# EAGLE design PowerBUS7 (EAGLE 7.5.0)
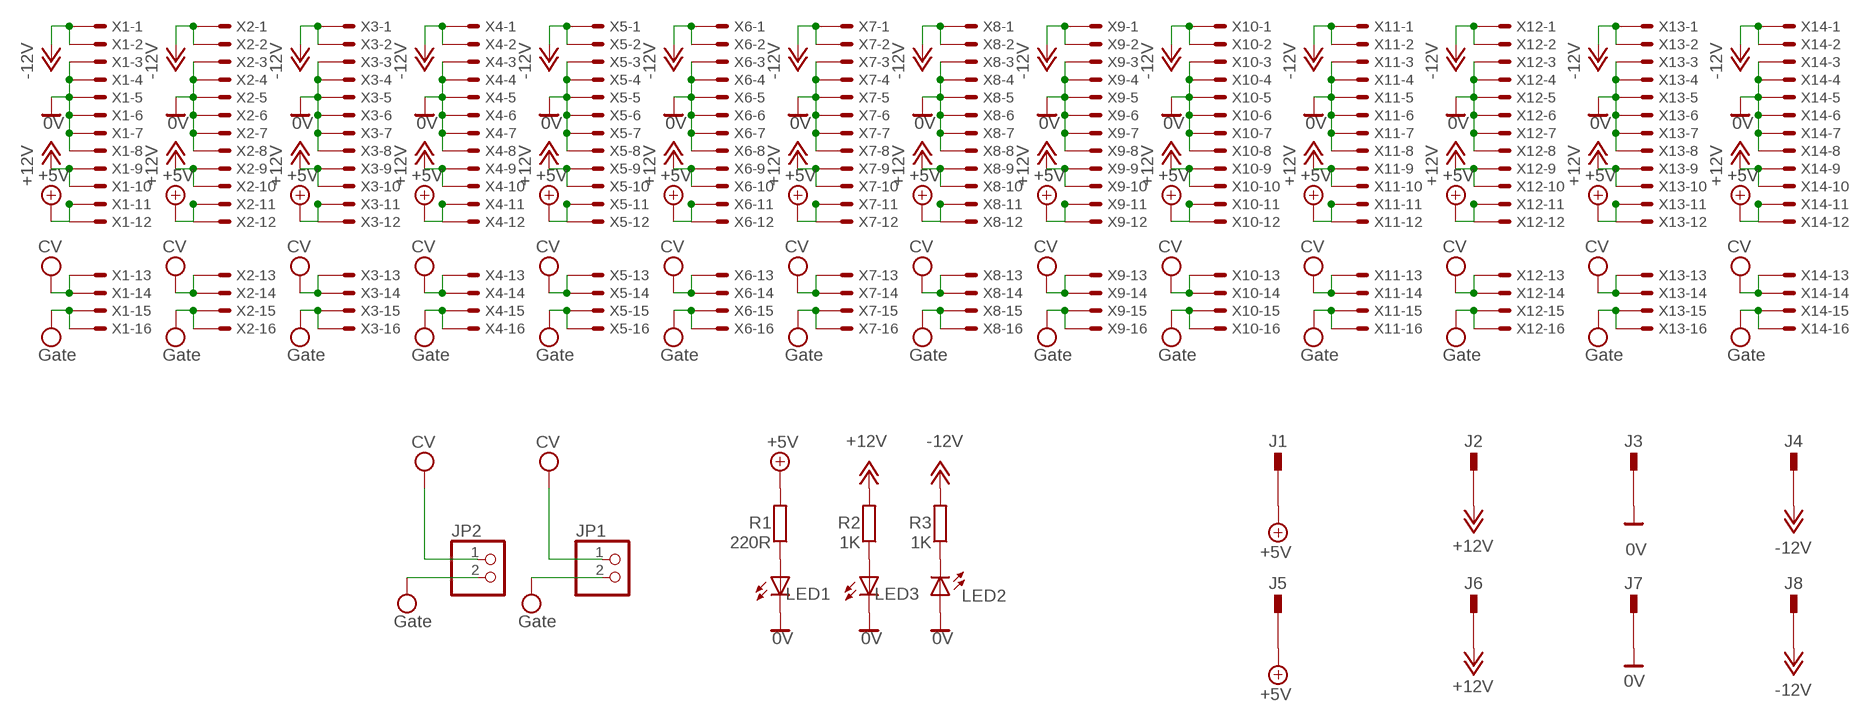
[diagram p0: schematic, sheet 1]

## Parts
J1  PIN2F061.040  [F061.040]
J2  PIN2F061.040  [F061.040]
J3  PIN2F061.040  [F061.040]
J4  PIN2F061.040  [F061.040]
J5  PIN2F061.040  [F061.040]
J6  PIN2F061.040  [F061.040]
J7  PIN2F061.040  [F061.040]
J8  PIN2F061.040  [F061.040]
JP1  PINHD-1X2  [1X02]
JP2  PINHD-1X2  [1X02]
LED1  LED5MM  [LED5MM]
LED2  LED5MM  [LED5MM]
LED3  LED5MM  [LED5MM]
R1  220R  R-EU_0204/5  [0204/5]
R2  1K  R-EU_0204/5  [0204/5]
R3  1K  R-EU_0204/5  [0204/5]
X1  057-016-1  [057-016-1]
X2  057-016-1  [057-016-1]
X3  057-016-1  [057-016-1]
X4  057-016-1  [057-016-1]
X5  057-016-1  [057-016-1]
X6  057-016-1  [057-016-1]
X7  057-016-1  [057-016-1]
X8  057-016-1  [057-016-1]
X9  057-016-1  [057-016-1]
X10  057-016-1  [057-016-1]
X11  057-016-1  [057-016-1]
X12  057-016-1  [057-016-1]
X13  057-016-1  [057-016-1]
X14  057-016-1  [057-016-1]

## Nets
0V: J3.A1 J3.A2 J7.A1 J7.A2 LED1.K(C) LED2.A LED3.K(C) X1.3 X1.4 X1.5 X1.6 X1.7 X1.8 X2.3 X2.4 X2.5 X2.6 X2.7 X2.8 X3.3 X3.4 X3.5 X3.6 X3.7 X3.8 X4.3 X4.4 X4.5 X4.6 X4.7 X4.8 X5.3 X5.4 X5.5 X5.6 X5.7 X5.8 X6.3 X6.4 X6.5 X6.6 X6.7 X6.8 X7.3 X7.4 X7.5 X7.6 X7.7 X7.8 X8.3 X8.4 X8.5 X8.6 X8.7 X8.8 X9.3 X9.4 X9.5 X9.6 X9.7 X9.8 X10.3 X10.4 X10.5 X10.6 X10.7 X10.8 X11.3 X11.4 X11.5 X11.6 X11.7 X11.8 X12.3 X12.4 X12.5 X12.6 X12.7 X12.8 X13.3 X13.4 X13.5 X13.6 X13.7 X13.8 X14.3 X14.4 X14.5 X14.6 X14.7 X14.8
+5V: J1.A1 J1.A2 J5.A1 J5.A2 R1.2 X1.11 X1.12 X2.11 X2.12 X3.11 X3.12 X4.11 X4.12 X5.11 X5.12 X6.11 X6.12 X7.11 X7.12 X8.11 X8.12 X9.11 X9.12 X10.11 X10.12 X11.11 X11.12 X12.11 X12.12 X13.11 X13.12 X14.11 X14.12
+12V: J2.A1 J2.A2 J6.A1 J6.A2 R2.2 X1.9 X1.10 X2.9 X2.10 X3.9 X3.10 X4.9 X4.10 X5.9 X5.10 X6.9 X6.10 X7.9 X7.10 X8.9 X8.10 X9.9 X9.10 X10.9 X10.10 X11.9 X11.10 X12.9 X12.10 X13.9 X13.10 X14.9 X14.10
-12V: J4.A1 J4.A2 J8.A1 J8.A2 R3.2 X1.1 X1.2 X2.1 X2.2 X3.1 X3.2 X4.1 X4.2 X5.1 X5.2 X6.1 X6.2 X7.1 X7.2 X8.1 X8.2 X9.1 X9.2 X10.1 X10.2 X11.1 X11.2 X12.1 X12.2 X13.1 X13.2 X14.1 X14.2
N$1: LED2.K(C) R3.1
N$4: LED1.A R1.1
N$6: LED3.A R2.1
VPP: JP1.1 JP2.1 X1.13 X1.14 X2.13 X2.14 X3.13 X3.14 X4.13 X4.14 X5.13 X5.14 X6.13 X6.14 X7.13 X7.14 X8.13 X8.14 X9.13 X9.14 X10.13 X10.14 X11.13 X11.14 X12.13 X12.14 X13.13 X13.14 X14.13 X14.14 ; supply symbol labelled CV
VSS: JP1.2 JP2.2 X1.15 X1.16 X2.15 X2.16 X3.15 X3.16 X4.15 X4.16 X5.15 X5.16 X6.15 X6.16 X7.15 X7.16 X8.15 X8.16 X9.15 X9.16 X10.15 X10.16 X11.15 X11.16 X12.15 X12.16 X13.15 X13.16 X14.15 X14.16 ; supply symbol labelled Gate

## Library data of the parts
J1-J8 = con-faston:PIN2: Flachstecker Typ Tyco/Electronics/AMP TAB, FASTON Printed Circuit Board Tabs Source: http://www.buerklin.com, http://catalog.tycoelectronics.com; OC_FARNELL: unknown; OC_NEWARK: unknown
JP1 JP2 = pinhead:PINHD-1X2: PIN HEADER
LED1-LED3 = led:LED: LED OSRAM: - CHIPLED LG R971, LG N971, LY N971, LG Q971, LY Q971, LO R971, LY R971 LH N974, LH R974 LS Q976, LO Q976, LY Q976 LO Q996 - Hyper CHIPLED LW Q18S LB Q993, LB Q99A, LB R99A - SideLED LS A670, LO A670, LY A670, LG A670, LP A670 LB A673, LV A673, LT A673, LW A673 LH A674 LY A675 LS A676, LA A676, LO A676, LY A676, LW A676 LS A679, LY A679, LG A679 - Hyper Micro SIDELED® LS Y876, LA Y876, LO Y876, LY Y876 LT Y87S - SmartLED LW L88C, LW L88S LB L89C, LB L89S, LG L890 LS L89K, LO L89K, LY L89K LS L896, LA L896, LO L896, LY L896 - TOPLED LS T670, LO T670, LY T670, LG T670, LP T670 LSG T670, LSP T670, LSY T670, LOP T670, LYG T670 LG T671, LOG T671, LSG T671 LB T673, LV T673, LT T673, LW T673 LH T674 LS T676, LA T676, LO T676, LY T676, LB T676, LH T676, LSB T676, LW T676 LB T67C, LV T67C, LT T67C, LS T67K, LO T67K, LY T67K, LW E67C LS E67B, LA E67B, LO E67B, LY E67B, LB E67C, LV E67C, LT E67C LW T67C LS T679, LY T679, LG T679 LS T770, LO T770, LY T770, LG T770, LP T770 LB T773, LV T773, LT T773, LW T773 LH T774 LS E675, LA E675, LY E675, LS T675 LS T776, LA T776, LO T776, LY T776, LB T776 LHGB T686 LT T68C, LB T68C - Hyper Mini TOPLED® LB M676 - Mini TOPLED Santana® LG M470 LS M47K, LO M47K, LY M47K Source: http://www.osram.convergy.de LUXEON: - LUMILED® LXK2-PW12-R00, LXK2-PW12-S00, LXK2-PW14-U00, LXK2-PW14-V00 LXK2-PM12-R00, LXK2-PM12-S00, LXK2-PM14-U00 LXK2-PE12-Q00, LXK2-PE12-R00, LXK2-PE12-S00, LXK2-PE14-T00, LXK2-PE14-U00 LXK2-PB12-K00, LXK2-PB12-L00, LXK2-PB12-M00, LXK2-PB14-N00, LXK2-PB14-P00, LXK2-PB14-Q00 LXK2-PR12-L00, LXK2-PR12-M00, LXK2-PR14-Q00, LXK2-PR14-R00 LXK2-PD12-Q00, LXK2-PD12-R00, LXK2-PD12-S00 LXK2-PH12-R00, LXK2-PH12-S00 LXK2-PL12-P00, LXK2-PL12-Q00, LXK2-PL12-R00 Source: www.luxeon.com KINGBRIGHT: KA-3528ASYC Source: www.kingbright.com
R1-R3 = rcl:R-EU_: RESISTOR, European symbol
X1-X14 = con-panduit:057-016-: CONNECTOR 10-pin series 057 contact pc board low profile headers; OC_FARNELL: unknown; OC_NEWARK: unknown

## Board
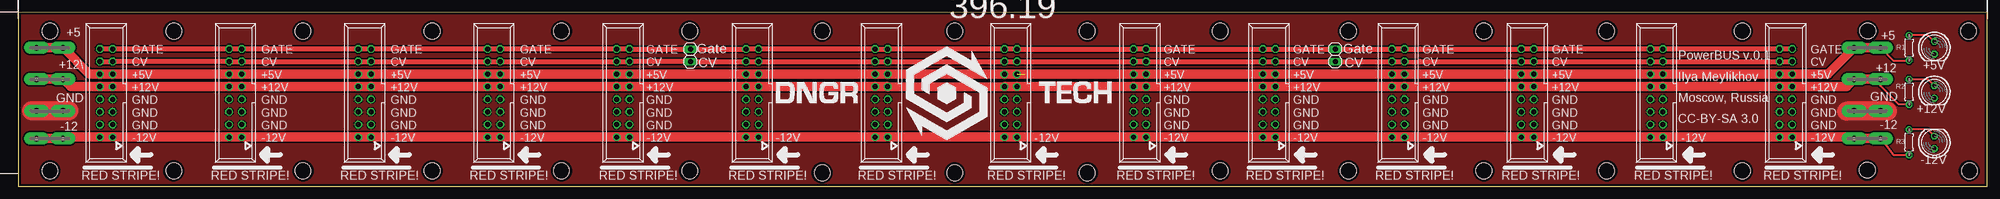
[diagram p1: board, top side]

Size 396.2 x 35.1 mm. Coordinates in mm from the lower left corner, seen from the top.
Outline: 0,0 396.2,0.02 396.2,35.02 0.01,35.1 0,0
Copper layers (1*16): Top 0.035mm / dielectric 1.5mm / Bottom 0.035mm
Design rules "default *": minimum track width 10mil, minimum drill 0.3mm, track to track 0.3mm, track to pad 0.3mm, pad to pad 0.3mm, via to via 0.3mm, smd to smd 0.3mm, copper to edge 20mil, drill to drill 8mil, minimum pad ring 10mil, minimum via ring 8mil, stop-mask expansion 4mil, vias tented up to drill 0mil, thermal gap 10mil
Holes 3.2 mm at 6.39,3.16 6.39,31.33 83.31,31.33 83.31,3.16 135.12,31.33 135.12,3.16 241.85,31.33 241.85,3.16 294.93,31.33 294.93,3.16 267.66,31.33 267.66,3.16 319.66,31.33 319.66,3.16 346.93,31.33 346.93,3.16 31.31,31.33 31.31,3.16 57.31,31.33 57.31,3.16 109.31,31.33 109.31,3.16 392.47,31.33 392.65,3.16 161.79,31.33 188.46,31.33 215.13,31.33 161.79,2.75 188.46,2.75 215.13,2.75 372.08,3.28 372.2,31.35
bKeepout: area 198.9,22.3 to 202.1,25.2; area 186.3,4 to 189,6.7

### Footprints (pad centres in the part's own frame; a part is rotated, then mirrored left to right if it is on the bottom)
F061.040 = drill 1.1 pad 2.54 long: A1 -2.65,0; A2 2.65,0
1X02 = drill 1.016 long: 1 -1.27,0; 2 1.27,0
LED5MM = drill 0.813 octagon: A -1.27,0; K 1.27,0
0204/5 = drill 0.813 octagon: 1 -2.54,0; 2 2.54,0
057-016-1 = drill 1 octagon: 1 -8.89,-1.27; 2 -8.89,1.27; 3 -6.35,-1.27; 4 -6.35,1.27; 5 -3.81,-1.27; 6 -3.81,1.27; 7 -1.27,-1.27; 8 -1.27,1.27; 9 1.27,-1.27; 10 1.27,1.27; 11 3.81,-1.27; 12 3.81,1.27; 13 6.35,-1.27; 14 6.35,1.27; 15 8.89,-1.27; 16 8.89,1.27

### Placement (x,y rotation side)
J1  6.36,27.96 0 top
J2  6.36,21.61 0 top
J3  6.36,15.26 0 top
J4  6.36,9.67 0 top
J5  372.12,27.96 0 top
J6  372.12,21.61 0 top
J7  372.12,15.26 0 top
J8  372.12,9.67 0 top
JP1  135.26,26.44 90 top
JP2  265.04,26.46 90 top
LED1  385.58,27.96 270 top
LED2  385.58,8.91 90 top
LED3  385.58,19.07 270 top
R1  380.5,27.96 270 top
R2  380.5,19.07 270 top
R3  380.5,8.91 270 top
X1  17.71,18.83 90 top
X2  43.71,18.83 90 top
X3  69.71,18.83 90 top
X4  95.71,18.83 90 top
X5  121.71,18.83 90 top
X6  147.71,18.83 90 top
X7  173.71,18.83 90 top
X8  225.71,18.83 90 top
X9  251.71,18.83 90 top
X10  277.71,18.83 90 top
X11  329.71,18.83 90 top
X12  303.71,18.83 90 top
X13  355.71,18.83 90 top
X14  199.71,18.83 90 top

### Tracks (layer width: path | path; a pad name or v marks a point on that pad's centre or on a via)
0V  (1 unrouted)
  Top 3.81: 2.64,15.3 10.22,15.3 | 376.2,15.17 367.97,15.17
  pour Top: -4.38,36.34 401.06,36.34 401.06,-2.52 -4.38,-2.52
+5V  (1 unrouted)
  Top 0.406: J5.A2 377.31,25.42 R1.2
  Top 1.93: 202.57,22.64 X7.11 X7.12 X6.11 X6.12 X5.11 X5.12 X4.11 X4.12 X3.11 X3.12 X2.11 X2.12 X1.11 X1.12 14.33,22.64 J1.A2 J1.A1 | X14.12 X14.11 226.88,22.63 X8.12 X8.11 X9.12 X9.11 X10.12 X10.11 X12.12 X12.11 X11.12 X11.11 X13.12 X13.11 364.15,22.64 J5.A1 J5.A2
+12V
  Top 0.406: 375.42,21.61 J6.A2 374.66,21.5 374.66,20.34 378.47,16.53 R2.2
  Top 1.93: J2.A1 J2.A2 10.52,20.1 X1.10 X1.9 X2.10 X2.9 X3.10 X3.9 X4.10 X4.9 X5.10 X5.9 X6.10 X6.9 X7.10 X7.9 175.08,20.09 X14.10 X14.9 X8.10 X8.9 X9.10 X9.9 X10.10 X10.9 X12.10 X12.9 X11.10 X11.9 X13.10 X13.9 367.96,20.1 J6.A1 J6.A2
-12V
  Top 0.406: J8.A2 377.31,6.37 R3.2
  Top 1.93: J4.A1 J4.A2 9.01,9.94 X1.2 X1.1 X2.2 X2.1 X3.2 X3.1 X4.2 X4.1 X5.2 X5.1 X6.2 X6.1 X7.2 X7.1 X14.2 X14.1 X8.2 X8.1 X9.2 X9.1 X10.2 X10.1 X12.2 X12.1 X11.2 X11.1 X13.2 X13.1 369.2,9.94 J8.A1 J8.A2
N$1
  Top 0.406: LED2.K 384.31,11.45 R3.1
N$4
  Top 0.406: LED1.A 384.31,30.5 R1.1
N$6
  Top 0.406: R2.1 384.31,21.61 LED3.A
VPP
  Top 1.016: X13.13 X13.14 X11.13 X11.14 X12.13 X12.14 282.13,25.18 282.07,25.12 X10.13 X10.14 276.44,25.19 JP2.1 263.77,25.18 X9.13 X9.14 X8.13 X8.14 226.88,25.17 X14.13 X14.14 X7.13 X7.14 X6.13 X6.14 135.28,25.18 JP1.1 X5.13 X5.14 X4.13 X4.14 X3.13 X3.14 X2.13 X2.14 X1.13 X1.14
VSS
  Top 1.016: X13.15 X13.16 X11.15 X11.16 X12.15 X12.16 282.13,27.72 282.07,27.66 X10.15 X10.16 276.44,27.73 JP2.2 263.77,27.72 X9.15 X9.16 X8.15 X8.16 X14.15 X14.16 176.35,27.71 X7.15 X7.16 X6.15 X6.16 135.28,27.72 JP1.2 122.99,27.71 X5.15 X5.16 X4.15 X4.16 X3.15 X3.16 X2.15 | 45.02,27.76 X2.15 | X2.15 X2.16 X1.15 X1.16

### Text on the board
tPlace: +5V | +12V | PowerBUS v.0.1 / Ilya Meylikhov / Moscow, Russia / CC-BY-SA 3.0 | GATE / CV / +5V / +12V / GND / GND / GND / -12V | GATE / CV / +5V / +12V / GND / GND / GND / -12V | GATE / CV / +5V / +12V / GND / GND / GND / -12V | GATE / CV / +5V / +12V / GND / GND / GND / -12V | GATE / CV / +5V / +12V / GND / GND / GND / -12V | -12V | -12V | GATE / CV / +5V / +12V / GND / GND / GND / -12V | GATE / CV / +5V / +12V / GND / GND / GND / -12V | GATE / CV / +5V / +12V / GND / GND / GND / -12V | GATE / CV / +5V / +12V / GND / GND / GND / -12V | -12V | GATE / CV / +5V / +12V / GND / GND / GND / -12V | -12V | RED STRIPE! | RED STRIPE! | RED STRIPE! | RED STRIPE! | RED STRIPE! | RED STRIPE! | RED STRIPE! | RED STRIPE! | RED STRIPE! | RED STRIPE! | RED STRIPE! | RED STRIPE! | RED STRIPE! | RED STRIPE!
tNames: +5 | +5 | Gate | Gate | CV | CV | +12 | +12\ | GND | GND | -12 | -12